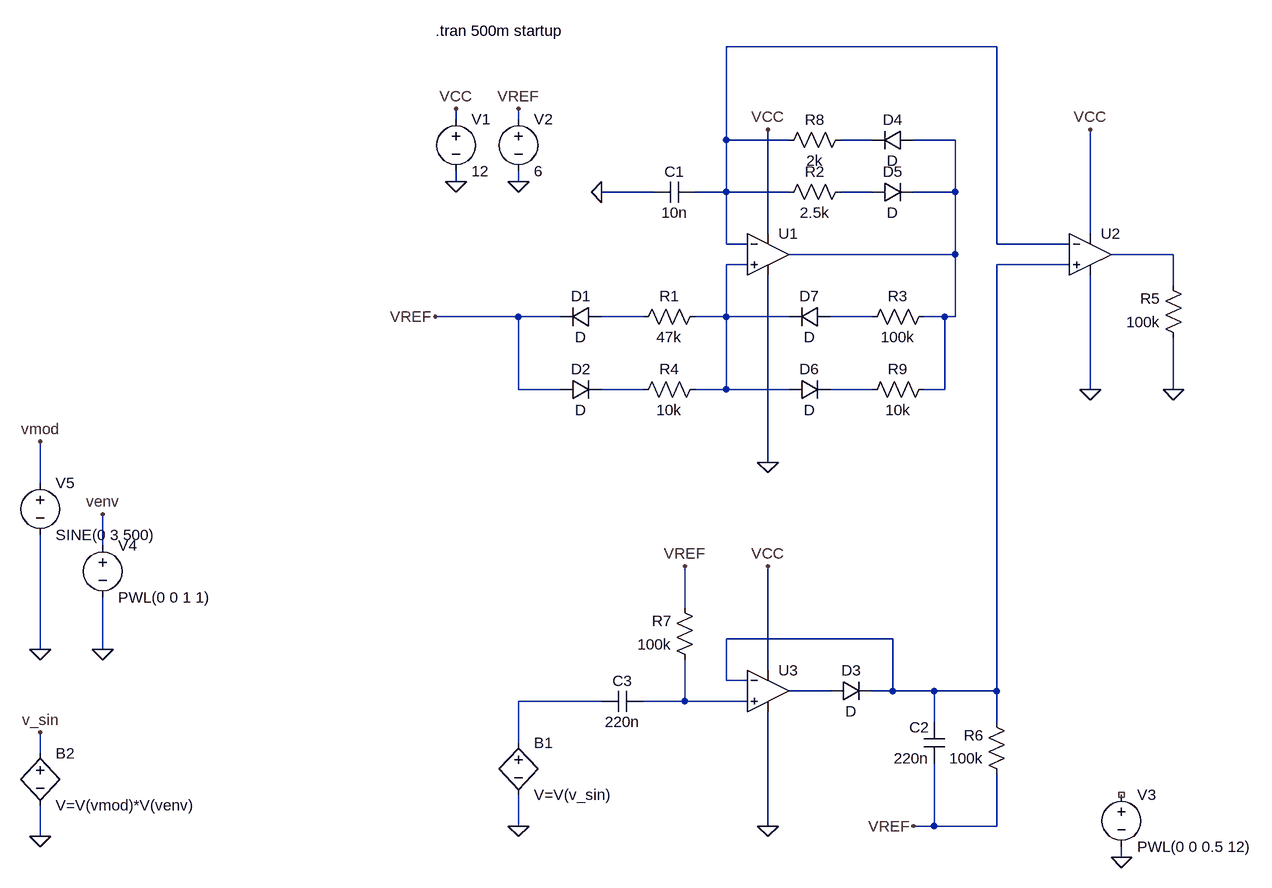
[diagram p0: schematic osc_mli_01.asc]
osc_mli_01.asc, the LTspice schematic file:
Version 4
SHEET 1 968 1124
WIRE 576 -144 160 -144
WIRE -256 -32 -256 -48
WIRE -160 -32 -160 -48
WIRE 160 0 160 -144
WIRE 256 0 160 0
WIRE 384 0 336 0
WIRE 512 0 448 0
WIRE -256 64 -256 48
WIRE -160 64 -160 48
WIRE 48 80 -32 80
WIRE 160 80 160 0
WIRE 160 80 112 80
WIRE 256 80 160 80
WIRE 384 80 336 80
WIRE 512 80 512 0
WIRE 512 80 448 80
WIRE 224 144 224 -16
WIRE 720 144 720 -16
WIRE 160 160 160 80
WIRE 192 160 160 160
WIRE 576 160 576 -144
WIRE 688 160 576 160
WIRE 512 176 512 80
WIRE 512 176 256 176
WIRE 848 176 752 176
WIRE 192 192 160 192
WIRE 688 192 576 192
WIRE 848 224 848 176
WIRE -160 272 -288 272
WIRE -96 272 -160 272
WIRE 32 272 -32 272
WIRE 160 272 160 192
WIRE 160 272 112 272
WIRE 256 272 160 272
WIRE 384 272 320 272
WIRE 496 272 464 272
WIRE 512 272 512 176
WIRE 512 272 496 272
WIRE -160 384 -160 272
WIRE -96 384 -160 384
WIRE 32 384 -32 384
WIRE 160 384 160 272
WIRE 160 384 112 384
WIRE 256 384 160 384
WIRE 384 384 320 384
WIRE 496 384 496 272
WIRE 496 384 464 384
WIRE 720 384 720 208
WIRE 848 384 848 304
WIRE 224 496 224 208
WIRE -896 528 -896 464
WIRE -800 624 -800 576
WIRE 96 720 96 656
WIRE 416 768 160 768
WIRE -896 784 -896 608
WIRE -800 784 -800 704
WIRE 224 816 224 656
WIRE 160 832 160 768
WIRE 192 832 160 832
WIRE 320 848 256 848
WIRE 416 848 416 768
WIRE 416 848 384 848
WIRE 480 848 416 848
WIRE 576 848 576 192
WIRE 576 848 480 848
WIRE -32 864 -160 864
WIRE 96 864 96 800
WIRE 96 864 32 864
WIRE 192 864 96 864
WIRE 480 896 480 848
WIRE 576 896 576 848
WIRE -160 928 -160 864
WIRE -896 944 -896 912
WIRE -160 1056 -160 1008
WIRE 224 1056 224 880
WIRE 480 1056 480 960
WIRE 480 1056 448 1056
WIRE 576 1056 576 976
WIRE 576 1056 480 1056
WIRE -896 1072 -896 1024
WIRE 768 1104 768 1088
FLAG -256 64 0
FLAG -256 -48 VCC
FLAG 224 496 0
FLAG 224 -16 VCC
FLAG -160 64 0
FLAG -160 -48 VREF
FLAG -32 80 0
FLAG -288 272 VREF
FLAG 720 384 0
FLAG 720 -16 VCC
FLAG 768 1104 0
FLAG 848 384 0
FLAG 224 1056 0
FLAG 224 656 VCC
FLAG 448 1056 VREF
FLAG 96 656 VREF
FLAG -160 1056 0
FLAG -896 784 0
FLAG -800 784 0
FLAG -896 1072 0
FLAG -896 464 vmod
FLAG -800 576 venv
FLAG -896 912 v_sin
SYMBOL Opamps\\UniversalOpamp2 224 176 R0
SYMATTR InstName U1
SYMBOL res 128 256 R90
WINDOW 0 0 56 VBottom 2
WINDOW 3 32 56 VTop 2
SYMATTR InstName R1
SYMATTR Value 47k
SYMBOL cap 112 64 R90
WINDOW 0 0 32 VBottom 2
WINDOW 3 32 32 VTop 2
SYMATTR InstName C1
SYMATTR Value 10n
SYMBOL res 352 64 R90
WINDOW 0 0 56 VBottom 2
WINDOW 3 32 56 VTop 2
SYMATTR InstName R2
SYMATTR Value 2.5k
SYMBOL res 480 256 R90
WINDOW 0 0 56 VBottom 2
WINDOW 3 32 56 VTop 2
SYMATTR InstName R3
SYMATTR Value 100k
SYMBOL voltage -256 -48 R0
SYMATTR InstName V1
SYMATTR Value 12
SYMBOL voltage -160 -48 R0
SYMATTR InstName V2
SYMATTR Value 6
SYMBOL diode -32 256 R90
WINDOW 0 0 32 VBottom 2
WINDOW 3 32 32 VTop 2
SYMATTR InstName D1
SYMBOL diode -96 400 R270
WINDOW 0 32 32 VTop 2
WINDOW 3 0 32 VBottom 2
SYMATTR InstName D2
SYMBOL res 128 368 R90
WINDOW 0 0 56 VBottom 2
WINDOW 3 32 56 VTop 2
SYMATTR InstName R4
SYMATTR Value 10k
SYMBOL Opamps\\UniversalOpamp2 720 176 R0
SYMATTR InstName U2
SYMBOL voltage 768 992 R0
WINDOW 123 0 0 Left 2
WINDOW 39 0 0 Left 2
SYMATTR InstName V3
SYMATTR Value PWL(0 0 0.5 12)
SYMBOL res 864 320 R180
WINDOW 0 36 76 Left 2
WINDOW 3 36 40 Left 2
SYMATTR InstName R5
SYMATTR Value 100k
SYMBOL Opamps\\UniversalOpamp2 224 848 R0
SYMATTR InstName U3
SYMBOL diode 320 864 R270
WINDOW 0 32 32 VTop 2
WINDOW 3 0 32 VBottom 2
SYMATTR InstName D3
SYMBOL cap 496 960 R180
WINDOW 0 24 56 Left 2
WINDOW 3 24 8 Left 2
SYMATTR InstName C2
SYMATTR Value 220n
SYMBOL res 592 992 R180
WINDOW 0 36 76 Left 2
WINDOW 3 36 40 Left 2
SYMATTR InstName R6
SYMATTR Value 100k
SYMBOL cap -32 880 R270
WINDOW 0 32 32 VTop 2
WINDOW 3 0 32 VBottom 2
SYMATTR InstName C3
SYMATTR Value 220n
SYMBOL res 112 816 R180
WINDOW 0 36 76 Left 2
WINDOW 3 36 40 Left 2
SYMATTR InstName R7
SYMATTR Value 100k
SYMBOL bv -160 912 R0
SYMATTR InstName B1
SYMATTR Value V=V(v_sin)
SYMBOL voltage -800 608 R0
WINDOW 123 0 0 Left 2
WINDOW 39 0 0 Left 2
SYMATTR InstName V4
SYMATTR Value PWL(0 0 1 1)
SYMBOL voltage -896 512 R0
WINDOW 123 24 44 Left 2
WINDOW 39 0 0 Left 2
SYMATTR InstName V5
SYMATTR Value SINE(0 3 500)
SYMBOL bv -896 928 R0
SYMATTR InstName B2
SYMATTR Value V=V(vmod)*V(venv)
SYMBOL res 352 -16 R90
WINDOW 0 0 56 VBottom 2
WINDOW 3 32 56 VTop 2
SYMATTR InstName R8
SYMATTR Value 2k
SYMBOL diode 448 -16 R90
WINDOW 0 0 32 VBottom 2
WINDOW 3 32 32 VTop 2
SYMATTR InstName D4
SYMBOL diode 384 96 R270
WINDOW 0 32 32 VTop 2
WINDOW 3 0 32 VBottom 2
SYMATTR InstName D5
SYMBOL diode 256 400 R270
WINDOW 0 32 32 VTop 2
WINDOW 3 0 32 VBottom 2
SYMATTR InstName D6
SYMBOL res 480 368 R90
WINDOW 0 0 56 VBottom 2
WINDOW 3 32 56 VTop 2
SYMATTR InstName R9
SYMATTR Value 10k
SYMBOL diode 320 256 R90
WINDOW 0 0 32 VBottom 2
WINDOW 3 32 32 VTop 2
SYMATTR InstName D7
TEXT -288 -168 Left 2 !.tran 500m startup

The netlist it stands for:
* osc_mli_01.asc
XU1 N006 N001 VCC 0 N003 level.2 Avol=1Meg GBW=10Meg Slew=10Meg ilimit=25m rail=0 Vos=0 phimargin=45 en=0 enk=0 in=0 ink=0 Rin=500Meg  ; pins IN+ IN- V+ V- OUT
R1 N006 N008 47k
C1 N001 0 10n
R2 N004 N001 2.5k
R3 N003 N009 100k
V1 VCC 0 12
V2 VREF 0 6
D1 N008 VREF D
D2 VREF N010 D
R4 N006 N010 10k
XU2 N007 N001 VCC 0 N005 level.2 Avol=1Meg GBW=10Meg Slew=10Meg ilimit=25m rail=0 Vos=0 phimargin=45 en=0 enk=0 in=0 ink=0 Rin=500Meg  ; pins IN+ IN- V+ V- OUT
V3 NC_01 0 PWL(0 0 0.5 12)
R5 0 N005 100k
XU3 N014 N007 VCC 0 N012 level.2 Avol=1Meg GBW=10Meg Slew=10Meg ilimit=25m rail=0 Vos=0 phimargin=45 en=0 enk=0 in=0 ink=0 Rin=500Meg  ; pins IN+ IN- V+ V- OUT
D3 N012 N007 D
C2 VREF N007 220n
R6 VREF N007 100k
C3 N013 N014 220n
R7 N014 VREF 100k
B1 N013 0 V=V(v_sin)
V4 venv 0 PWL(0 0 1 1)
V5 vmod 0 SINE(0 3 500)
B2 v_sin 0 V=V(vmod)*V(venv)
R8 N002 N001 2k
D4 N003 N002 D
D5 N004 N003 D
D6 N006 N011 D
R9 N003 N011 10k
D7 N009 N006 D
.model D D
.lib standard.dio
.tran 500m startup
.lib UniversalOpamps2.sub
.backanno
.end